# EAGLE design lipo_charger (EAGLE 6.6.0)
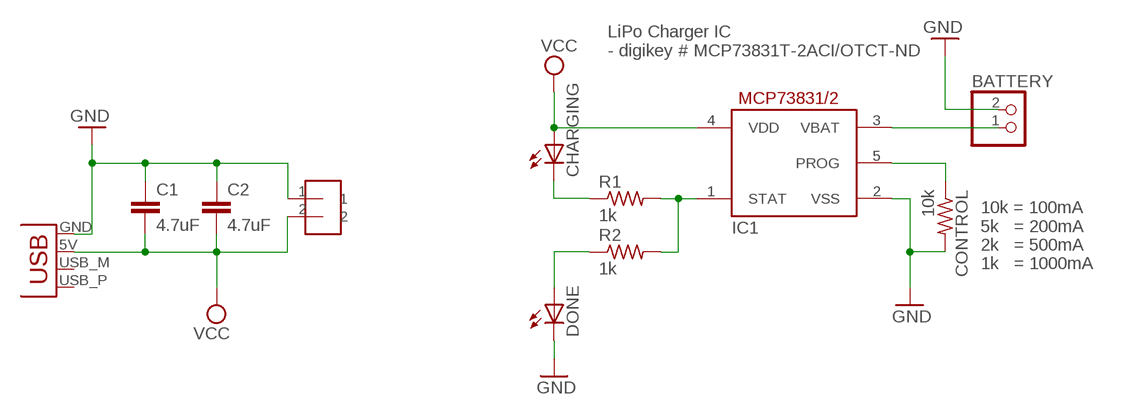
[diagram p0: schematic, sheet 1]

## Parts
BATTERY  JST_2PIN-SMT-RA  [JST-PH-2-SMT-RA]
C1  4.7uF  CAP0603-CAP  [0603-CAP]
C2  4.7uF  CAP0603-CAP  [0603-CAP]
CHARGING  LEDCHIPLED_0603  [CHIPLED_0603]
CONTROL  10k  R-US_R0603  [R0603]
DONE  LEDCHIPLED_0603  [CHIPLED_0603]
IC1  MCP73831/OT  [SOT23-5L]
JP1  USBPCB  [USB-A-PCB]
R1  1k  R-US_R0603  [R0603]
R2  1k  R-US_R0603  [R0603]
U$1  HEADER-2  [HEADER-2]

## Nets
GND: BATTERY.2 C1.1 C2.1 CONTROL.2 DONE.C IC1.2(VSS) JP1.GND U$1.1
N$1: IC1.1(STAT) R1.2 R2.2
N$2: CHARGING.C R1.1
N$3: DONE.A R2.1
N$5: BATTERY.1 IC1.3(VBAT)
N$6: CONTROL.1 IC1.5(PROG)
VCC: C1.2 C2.2 CHARGING.A IC1.4(VDD) JP1.5V(VBUS) U$1.2
Unconnected: JP1.USB_M(D-) JP1.USB_P(D+)

## Notes on the sheet
- LiPo Charger IC
  - digikey # MCP73831T-2ACI/OTCT-ND
- 10k = 100mA
  5k   = 200mA
  2k   = 500mA
  1k   = 1000mA

## Library data of the parts
BATTERY = adafruit:JST_2PIN: JST 2-Pin Connectors of various flavors SMT-RA (S2B-PH-SM4) 4UConnector #17311 SMT (B2B-PH-SM4) THM-RA (S2B-PH) THM (B2B-PH)
C1 C2 = SparkFun-Capacitors:CAP: Capacitor Standard 0603 ceramic capacitor, and 0.1" leaded capacitor.
CHARGING DONE = adafruit:LED: LED OSRAM: - CHIPLED LG R971, LG N971, LY N971, LG Q971, LY Q971, LO R971, LY R971 LH N974, LH R974 LS Q976, LO Q976, LY Q976 LO Q996 - Hyper CHIPLED LW Q18S LB Q993, LB Q99A, LB R99A - SideLED LS A670, LO A670, LY A670, LG A670, LP A670 LB A673, LV A673, LT A673, LW A673 LH A674 LY A675 LS A676, LA A676, LO A676, LY A676, LW A676 LS A679, LY A679, LG A679 - Hyper Micro SIDELED® LS Y876, LA Y876, LO Y876, LY Y876 LT Y87S - SmartLED LW L88C, LW L88S LB L89C, LB L89S, LG L890 LS L89K, LO L89K, LY L89K LS L896, LA L896, LO L896, LY L896 - TOPLED LS T670, LO T670, LY T670, LG T670, LP T670 LSG T670, LSP T670, LSY T670, LOP T670, LYG T670 LG T671, LOG T671, LSG T671 LB T673, LV T673, LT T673, LW T673 LH T674 LS T676, LA T676, LO T676, LY T676, LB T676, LH T676, LSB T676, LW T676 LB T67C, LV T67C, LT T67C, LS T67K, LO T67K, LY T67K, LW E67C LS E67B, LA E67B, LO E67B, LY E67B, LB E67C, LV E67C, LT E67C LW T67C LS T679, LY T679, LG T679 LS T770, LO T770, LY T770, LG T770, LP T770 LB T773, LV T773, LT T773, LW T773 LH T774 LS E675, LA E675, LY E675, LS T675 LS T776, LA T776, LO T776, LY T776, LB T776 LHGB T686 LT T68C, LB T68C - Hyper Mini TOPLED® LB M676 - Mini TOPLED Santana® LG M470 LS M47K, LO M47K, LY M47K Source: http://www.osram.convergy.de/
CONTROL R1 R2 = adafruit:R-US_: RESISTOR, American symbol
IC1 = adafruit:MCP73831: MCP73831/2 Miniature Single-Cell, Fully Integrated Li-Ion, Li-Polymer Charge Management Controllers. Nice and small simple lipoly charge controller, with adjustable current and status output (LED) http://www.ladyada.net/library/pcb/eaglelibrary.html
JP1 = SparkFun-Connectors:USB: USB Connectors USB-B-PTH is fully proven SKU : PRT-00139/CONN-08278 USB-miniB is fully proven SKU : PRT-00587 USB-A-PCB is untested. USB-A-H is throughly reviewed, but untested. Spark Fun Electronics SKU : PRT-00437 USB-B-SMT is throughly reviewed, but untested. Needs silkscreen touching up. USB-A-S has not been used/tested USB-MB-H has not been used/tested USB-MICROB has been used. CONN-09505
U$1 = homemade-hardware:HEADER-2

## Board
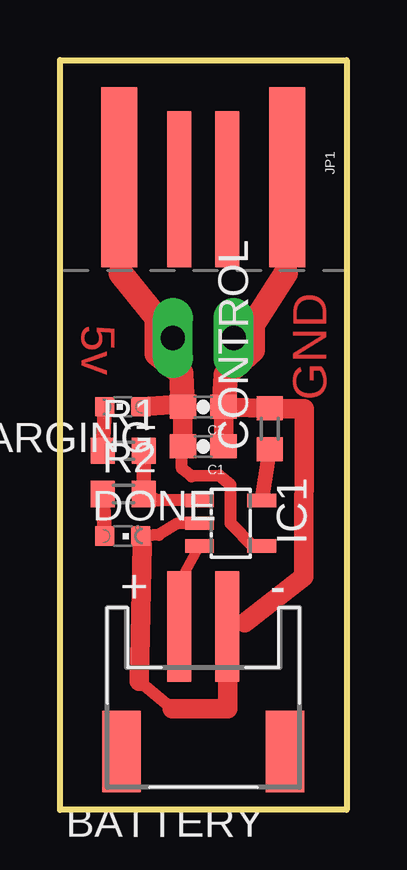
[diagram p1: board, top side]

Size 11.94 x 31.24 mm. Coordinates in mm from the lower left corner, seen from the top.
Outline: 0,31.24 11.94,31.24 11.94,0 0,0 0,31.24
Copper layers (1*16): Top 0.035mm / dielectric 1.5mm / Bottom 0.035mm
Design rules "default": minimum track width 10mil, minimum drill 24mil, track to track 8mil, track to pad 8mil, pad to pad 8mil, via to via 8mil, smd to smd 8mil, copper to edge 40mil, drill to drill 8mil, minimum pad ring 10mil, minimum via ring 8mil, stop-mask expansion 4mil, vias tented up to drill 0mil, thermal gap 10mil

### Footprints (pad centres in the part's own frame; a part is rotated, then mirrored left to right if it is on the bottom)
JST-PH-2-SMT-RA = smd 1 x 4.6: 1 1,-3.7; 2 -1,-3.7 | smd 1.6 x 3.4: NC1 -3.4,1.5; NC2 3.4,1.5
0603-CAP = smd 1.1 x 1: 1 -0.85,0; 2 0.85,0
CHIPLED_0603 = smd 0.8 x 0.8: A 0,-0.75; C 0,0.75
R0603 = smd 1 x 1.1: 1 -0.85,0; 2 0.85,0
SOT23-5L = smd 0.55 x 1.2: 1 -0.95,-1.3; 2 0,-1.3; 3 0.95,-1.3; 4 0.95,1.3; 5 -0.95,1.3
USB-A-PCB = smd 7.5 x 1.5: 5V -0.2,-3.5; GND -0.2,3.5 | smd 6.5 x 1: USB_M 0.3,-1; USB_P 0.3,1
HEADER-2 = drill 1.016 pad 1.676 long: 1 0,0; 2 0,2.54

### Placement (x,y rotation side)
BATTERY  5.97,3.94 180 top
C1  5.97,15.14 180 top
C2  5.97,16.79 180 top
CHARGING  2.62,16.79 90 top
CONTROL  8.74,15.88 90 top
DONE  2.62,11.4 270 top
IC1  7.11,11.94 270 top
JP1  5.97,26.16 270 top
R1  2.64,14.96 0 top
R2  2.64,13.16 0 top
U$1  7.24,19.66 90 top

### Tracks (layer width: path | path; a pad name or v marks a point on that pad's centre or on a via)
GND
  Top 0.406: 7.69,7.8 BATTERY.2 | 3.43,11.05 DONE.C | JP1.GND 9.4,22.35 | 7.04,16.66 8.41,16.71 CONTROL.2 | 6.98,16.78 C2.1
  Top 0.508: 4.67,4.22 3.3,5.36 | DONE.C 4.11,11.46 4.9,11.94 IC1.2
  Top 0.813: BATTERY.2 6.98,4.22 4.67,4.22 | 7.69,7.8 10.16,9.71 10.19,16.71 8.41,16.71 | 3.3,5.36 3.43,11.05 | C2.1 C1.1 | CONTROL.2 6.98,16.78
  Top 1.016: 9.4,22.35 8.03,20.22 8.03,19.3 | 8.03,19.3 8.03,19.15 6.91,18.14 C2.1 | U$1.1 8.03,19.3
N$1
  Top 0.508: IC1.1 4.09,12.89 R2.2
  Top 0.61: R1.2 R2.2
N$2
  Top 0.61: CHARGING.C R1.1
N$3
  Top 0.61: R2.1 DONE.A
N$5
  Top 0.406: BATTERY.1 5.08,9.4 5.21,9.88 IC1.3
N$6
  Top 0.61: IC1.5 CONTROL.1
VCC
  Top 0.406: JP1.5V 2.54,22.35 | IC1.4 8.06,10.99 | 5.08,14.95 C1.2 | C2.2 CHARGING.A
  Top 0.508: 8.06,10.99 7.11,11.94 7.11,13.54 6.65,13.92 5.49,13.89 5.08,14.22 5.08,14.95
  Top 0.813: CHARGING.A 4.97,16.89 | C2.2 C1.2
  Top 1.016: 2.54,22.35 4.04,20.5 4.04,19.3 | 4.04,19.3 4.04,19 5.05,18.19 C2.2 | U$1.2 4.04,19.3

### Text on the board
Top: 5v | GND